# EasyEDA Pro project ProPrj_Pi Essential HAT.epro, board PCB1
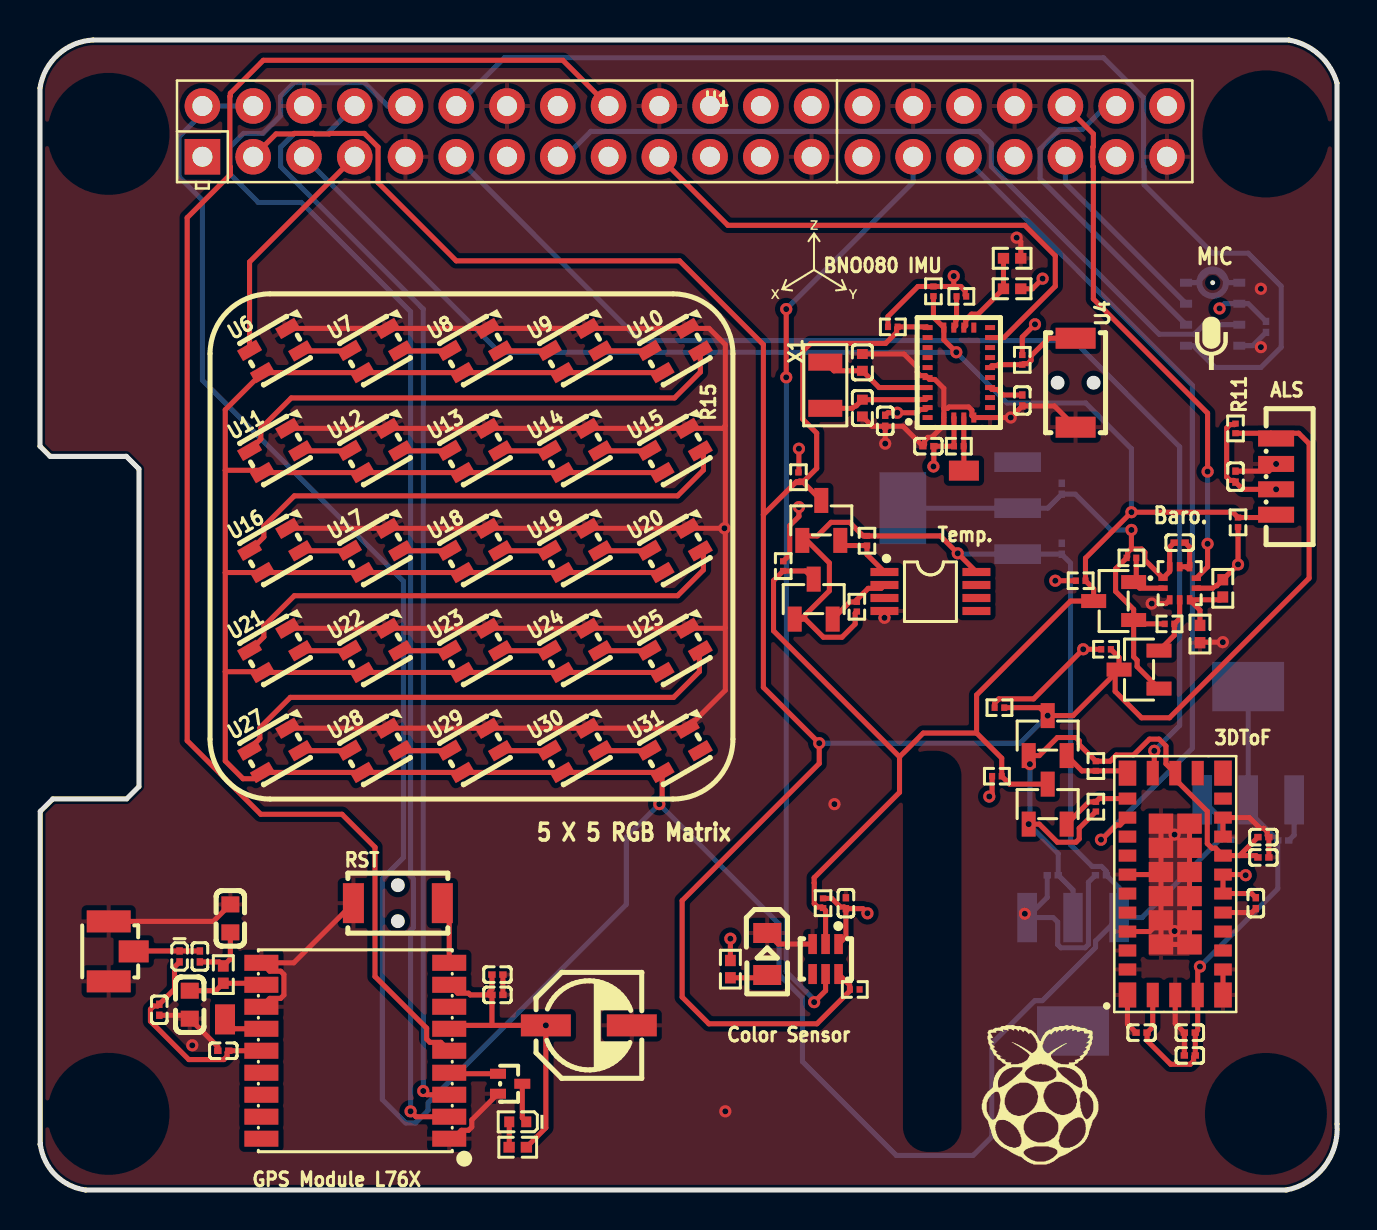
[diagram p1: board, top side]
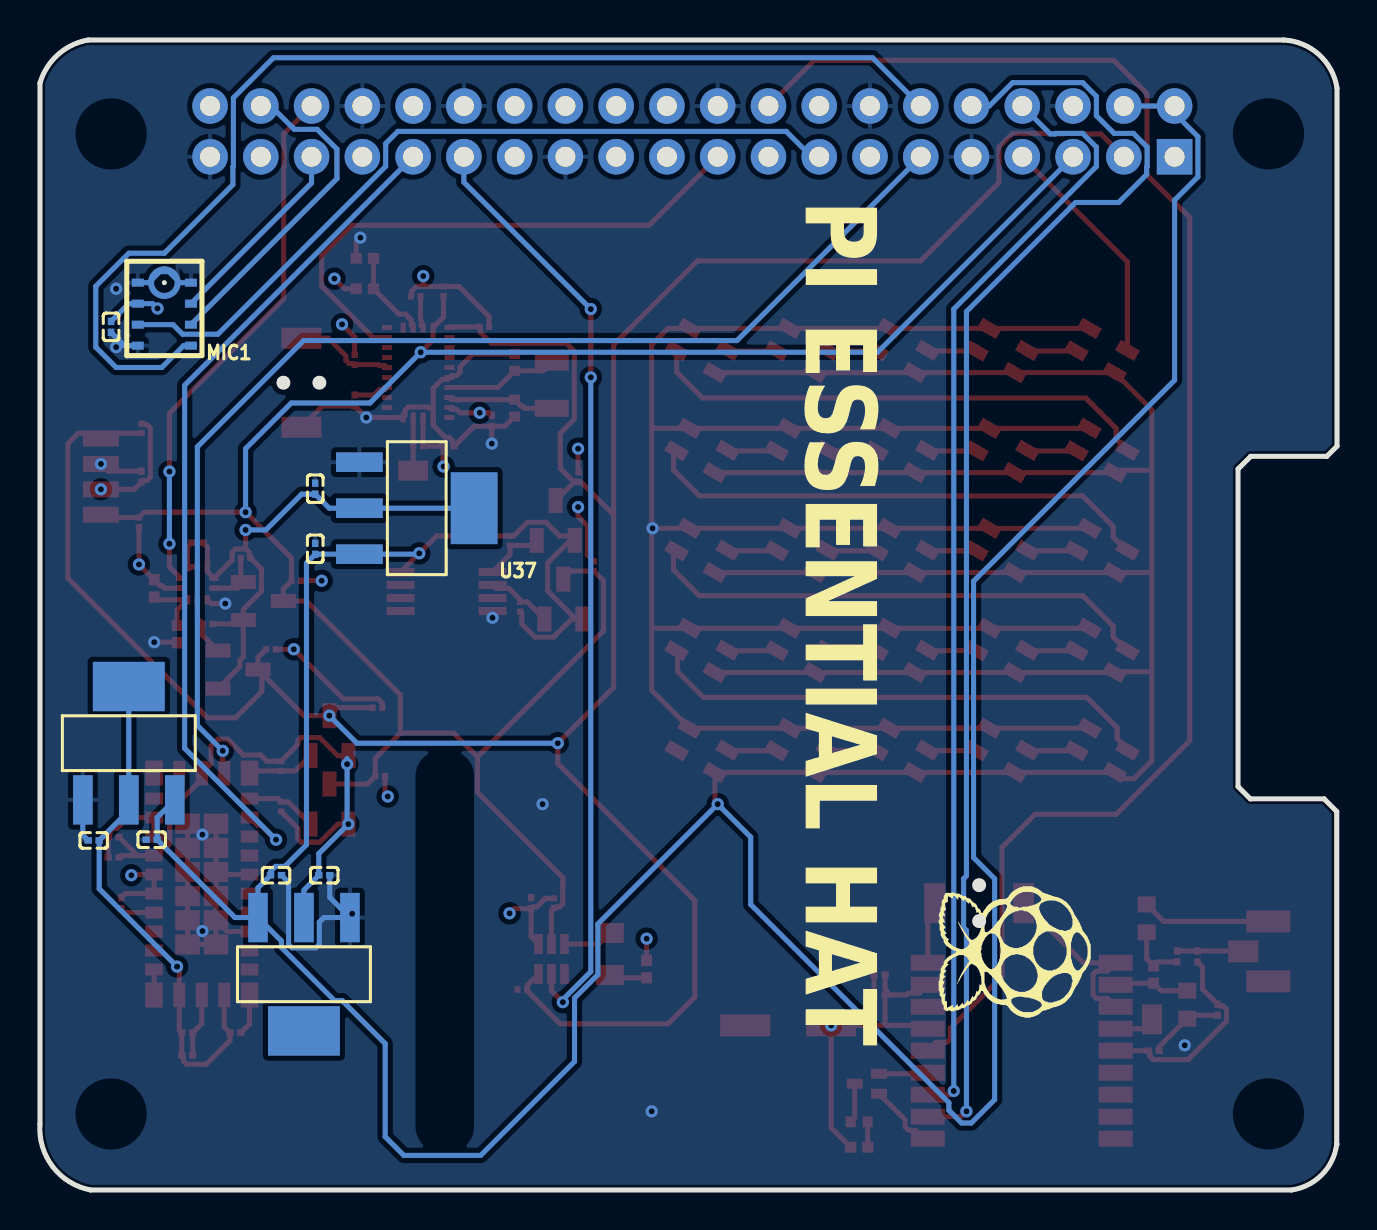
[diagram p2: board, bottom side, seen from below]

Outline 64.9 x 57.53 mm; copper layers: Top Layer, Inner1, Inner2, Bottom Layer. Coordinates in mm from the lower left corner of the outline.
Outline path: 0.01,2.3 0.01,18.94 0.64,19.57 4.34,19.57 4.95,20.18 4.95,36.07 4.32,36.7 0.51,36.7 0,37.21 0,55.12 arc(0.9,56.8) 2.67,57.53 62.48,57.53 arc(64,56.8) 64.9,55.37 64.9,3.3 arc(64.26,1.17) 62.36,0 2.29,0 arc(0.76,0.76) 0.01,2.3 ; 0.01,2.3 0,2.29
Stack: Top Layer 0.035mm Outer layer thickness 1oz / Dielectric1 0.2104mm 7628 RC49% 8.6mil / Inner1 0.0152mm Inner layer thickness / Dielectric2 1.065mm 1.1mm H/HOZ Copper / Inner2 0.0152mm Inner layer thickness / Dielectric3 0.2104mm 7628 RC49% 8.6mil / Bottom Layer 0.035mm Outer layer thickness 1oz

## Design rules (mm)
spacing copperThickness1oz (default): track to track 0.102, other pairs 0.152 to 0.3
spacing copperThickness2oz: track to track 0.203, other pairs 0.152 to 0.3
track width copperThickness1oz (default): min 0.127, default 0.254, max 2.54
track width copperThickness2oz: min 0.203, default 0.254, max 2.54
differential pair differentialPair (default): width min 0.127, default 0.254, max 2.54; gap min 0.152, default 0.152
net GND uses copperRegion
net VCC uses copperRegion

## Placement (name value [footprint] x y rotation side)
3DToF  VL53L9CXV0VE/1  [COMM-SMD_42P-L12.8-W6.1_VL53L9CXV0VE-1]  56.8 15.31 270 top
ALS  VEML7700-TR  [LED-SMD_4P-L6.8-W2.4_VEML7700-TR]  61.85 35.69 270 top
BNO080 IMU  BNO080  [LGA-28_L5.2-W3.8-P0.50-BL-1]  45.97 40.89 0 top
C1  100nF  [C0201]  40.32 14.35 270 top
C2  100nF  [C0201]  42.29 38.48 90 top
C3  22pF  [C0402]  41.15 39.12 270 top
C4  100nF  [C0201]  44.45 37.21 180 top
C5  22pF  [C0402]  41.15 41.4 90 top
C6  100nF  [C0201]  49.15 39.5 270 top
C7  100nF  [C0201]  59.82 35.69 90 top
C8  100nF  [C0201]  61.21 17.65 180 top
C9  100nF  [C0201]  61.21 16.64 180 top
C10  100nF  [C0201]  60.83 14.35 90 top
C11  100nF  [C0201]  55.12 7.87 0 top
C12  100nF  [C0201]  57.53 6.73 0 top
C13  100nF  [C0201]  57.53 7.87 0 top
C14  100nF  [C0201]  5.97 9.02 90 top
C15  100nF  [C0201]  61.34 43.18 90 bottom
C16  100uF  [CAP-SMD_BD5.0-L5.3-W5.3-RD]  27.46 8.24 180 top
C17  100nF  [C0201]  22.89 9.76 0 top
C18  DNP  [C0603]  7.49 9.27 270 top
C19  100pF  [C0201]  8 11.68 90 top
C20  4.7uF  [C0201]  22.89 10.78 180 top
C21  DNP  [C0603]  9.52 13.59 90 top
C22  100nF  [C0201]  9.17 6.97 180 top
C23  100nF  [C0201]  57.02 32.38 0 top
C24  100nF  [C0201]  62.21 17.49 0 bottom
C25  100nF  [C0201]  50.67 15.75 180 bottom
C26  100nF  [C0201]  51.12 32.08 90 bottom
C27  100nF  [C0201]  53.09 15.75 180 bottom
C28  100nF  [C0201]  59.31 17.53 180 bottom
C29  100nF  [C0201]  51.12 35.08 90 bottom
CN1  5017  [CONN-SMD_5017]  46.23 35.99 0 top
CN2  5017  [CONN-SMD_5017]  9.26 8.53 270 top
Color Sensor  TCS34725FN  [SENSOR-SMD_TCS34725FN]  39.31 11.55 270 top
GPS Module L76X  L76KB-A58  [GPSM-SMD_18P-L10.1-W9.7-P1.10]  15.78 6.97 180 top
JP1  6GHz  [ANT-SMD_UFL-R-SMT-1-10]  4.06 11.94 180 top
L1  47nH  [L0201-RD]  6.98 11.68 270 top
LED1  KT-0805W  [LED0805-R-RD]  36.39 11.81 270 top
LED3  YLED0402P  [LED0402-RD]  23.9 3.41 180 top
MIC1  INMP441  [MIC-SMD_INMP441]  58.67 43.81 0 bottom
Q1  BSS138  [SOT-23-3_L2.9-W1.3-P1.90-LS2.4-BR-1]  38.71 29.56 270 top
Q2  BSS138  [SOT-23-3_L2.9-W1.3-P1.90-LS2.4-BR-1]  50.42 19.3 270 top
Q3  BSS138  [SOT-23-3_L2.9-W1.3-P1.90-LS2.4-BR-1]  39.09 33.5 270 top
Q4  BSS138  [SOT-23-3_L2.9-W1.3-P1.90-LS2.4-BR-1]  50.42 22.73 270 top
Q5  BSS138  [SOT-23-3_L2.9-W1.3-P1.90-LS2.4-BR-1]  53.72 29.46 0 top
Q6  BSS138  [SOT-23-3_L2.9-W1.3-P1.90-LS2.4-BR-1]  54.99 26.03 0 top
Q7  CJ1012  [SOT-523_L1.6-W0.8-P1.00-LS1.6-BR]  23.52 5.32 180 top
R1  4.7kΩ  [R0201]  40.77 10.03 180 top
R2  4.7kΩ  [R0201]  39.18 14.35 270 top
R3  10kΩ  [R0201]  45.97 37.21 180 top
R4  4.7kΩ  [R0201]  42.67 43.18 180 top
R5  4.7kΩ  [R0201]  44.7 44.96 90 top
R6  10kΩ  [R0201]  46.1 44.7 180 top
R7  10kΩ  [R0201]  49.15 41.53 270 top
R8  0Ω  [R0402]  48.64 45.08 0 top
R9  0Ω  [R0402]  48.64 46.61 0 top
R10  4.7kΩ  [R0201]  59.94 33.4 90 top
R11  4.7kΩ  [R0201]  59.82 38.1 270 top
R12  4.7kΩ  [R0201]  37.19 31.21 270 top
R13  4.7kΩ  [R0201]  41.38 32.48 270 top
R14  4.7kΩ  [R0201]  47.88 20.7 0 top
R15  4.7kΩ  [R0201]  37.95 35.66 270 top
R16  4.7kΩ  [R0201]  52.83 19.18 90 top
R17  4.7kΩ  [R0201]  40.87 29.18 90 top
R18  4.7kΩ  [R0201]  48.01 24.13 0 top
R19  4.7kΩ  [R0201]  52.83 21.21 270 top
R20  4.7kΩ  [R0201]  52.07 30.48 0 top
R21  4.7kΩ  [R0201]  54.61 31.62 0 top
R22  0Ω  [R0402]  9.17 10.78 90 top
R23  4.7kΩ  [R0201]  53.34 27.05 0 top
R24  2.7kΩ  [R0402]  23.9 2.14 180 top
R25  4.7kΩ  [R0201]  56.52 28.32 0 top
R26  0Ω  [R0402]  58.04 27.81 270 top
R27  0Ω  [R0402]  59.18 30.1 90 top
R28  2.7kΩ  [R0402]  34.54 11.05 90 top
RST  BX-TS-26-3425TP  [KEY-SMD_L3.9-W3.0-LS5.0-EH]  17.91 14.35 0 top
Temp.  MCP9808-E/MS  [MSOP-8_L3.0-W3.0-P0.65-LS4.9-BL]  44.55 29.94 270 top
U1  -  [RASPI_GPIO_B+_PIN]  32.26 52.96 0 top
U4  BX-TS-26-3425TP  [KEY-SMD_L3.9-W3.0-LS5.0-EH]  51.82 40.39 270 top
U6  WS2812B-2427-V6  [LED-SMD_4P-L2.7-W2.4-P1.30_WS2812B-2427-V6]  11.76 41.99 30 top
U7  WS2812B-2427-V6  [LED-SMD_4P-L2.7-W2.4-P1.30_WS2812B-2427-V6]  16.76 41.99 30 top
U8  WS2812B-2427-V6  [LED-SMD_4P-L2.7-W2.4-P1.30_WS2812B-2427-V6]  21.76 41.99 30 top
U9  WS2812B-2427-V6  [LED-SMD_4P-L2.7-W2.4-P1.30_WS2812B-2427-V6]  26.76 41.99 30 top
U10  WS2812B-2427-V6  [LED-SMD_4P-L2.7-W2.4-P1.30_WS2812B-2427-V6]  31.76 41.99 30 top
U11  WS2812B-2427-V6  [LED-SMD_4P-L2.7-W2.4-P1.30_WS2812B-2427-V6]  11.76 36.99 30 top
U12  WS2812B-2427-V6  [LED-SMD_4P-L2.7-W2.4-P1.30_WS2812B-2427-V6]  16.76 36.99 30 top
U13  WS2812B-2427-V6  [LED-SMD_4P-L2.7-W2.4-P1.30_WS2812B-2427-V6]  21.76 36.99 30 top
U14  WS2812B-2427-V6  [LED-SMD_4P-L2.7-W2.4-P1.30_WS2812B-2427-V6]  26.76 36.99 30 top
U15  WS2812B-2427-V6  [LED-SMD_4P-L2.7-W2.4-P1.30_WS2812B-2427-V6]  31.76 36.99 30 top
U16  WS2812B-2427-V6  [LED-SMD_4P-L2.7-W2.4-P1.30_WS2812B-2427-V6]  11.76 31.99 30 top
U17  WS2812B-2427-V6  [LED-SMD_4P-L2.7-W2.4-P1.30_WS2812B-2427-V6]  16.76 31.99 30 top
U18  WS2812B-2427-V6  [LED-SMD_4P-L2.7-W2.4-P1.30_WS2812B-2427-V6]  21.76 31.99 30 top
U19  WS2812B-2427-V6  [LED-SMD_4P-L2.7-W2.4-P1.30_WS2812B-2427-V6]  26.76 31.99 30 top
U20  WS2812B-2427-V6  [LED-SMD_4P-L2.7-W2.4-P1.30_WS2812B-2427-V6]  31.76 31.99 30 top
U21  WS2812B-2427-V6  [LED-SMD_4P-L2.7-W2.4-P1.30_WS2812B-2427-V6]  11.76 26.99 30 top
U22  WS2812B-2427-V6  [LED-SMD_4P-L2.7-W2.4-P1.30_WS2812B-2427-V6]  16.76 26.99 30 top
U23  WS2812B-2427-V6  [LED-SMD_4P-L2.7-W2.4-P1.30_WS2812B-2427-V6]  21.76 26.99 30 top
U24  WS2812B-2427-V6  [LED-SMD_4P-L2.7-W2.4-P1.30_WS2812B-2427-V6]  26.76 26.99 30 top
U25  WS2812B-2427-V6  [LED-SMD_4P-L2.7-W2.4-P1.30_WS2812B-2427-V6]  31.76 26.99 30 top
U27  WS2812B-2427-V6  [LED-SMD_4P-L2.7-W2.4-P1.30_WS2812B-2427-V6]  11.76 21.99 30 top
U28  WS2812B-2427-V6  [LED-SMD_4P-L2.7-W2.4-P1.30_WS2812B-2427-V6]  16.76 21.99 30 top
U29  WS2812B-2427-V6  [LED-SMD_4P-L2.7-W2.4-P1.30_WS2812B-2427-V6]  21.76 21.99 30 top
U30  WS2812B-2427-V6  [LED-SMD_4P-L2.7-W2.4-P1.30_WS2812B-2427-V6]  26.76 21.99 30 top
U31  WS2812B-2427-V6  [LED-SMD_4P-L2.7-W2.4-P1.30_WS2812B-2427-V6]  31.76 21.99 30 top
U34  LPS22HHTR  [HLGA-10L_LPS22HBTR]  57.02 30.35 0 top
U35  AMS1117-3.3V  [SOT-223-4_L6.5-W3.5-P2.30-LS7.0-BR]  60.45 22.35 270 bottom
U36  AMS1117-1.2V  [SOT-223-4_L6.5-W3.5-P2.30-LS7.0-BR]  51.69 10.79 90 bottom
U37  AMS1117-1.8V  [SOT-223-3_L6.7-W3.7-P2.30-LS7.0-BR_2]  46.05 34.11 0 bottom
X1  32.768kHz  [OSC-SMD_L3.2-W1.5]  39.29 40.26 270 top

## Footprints (pads in the part's own frame, mm; a bottom-side part is the same pattern mirrored in y, then rotated)
ANT-SMD_UFL-R-SMT-1-10
  rect 2.2x1.1 smd: 1(0.625,1.5) 3(0.625,-1.5)
  rect 1.5x1.1 smd: 2(-0.625,0.001)
C0201
  rect 0.368x0.324 smd: 1(-0.275,0) 2(0.275,0)
C0402
  rect 0.5x0.54 smd: 1(-0.42,0) 2(0.42,0)
C0603
  rect 0.8x0.9 smd: 1(-0.7,0) 2(0.7,0)
CAP-SMD_BD5.0-L5.3-W5.3-RD
  rect 2.5x1.1 smd: 1(2.15,0) 2(-2.15,0)
COMM-SMD_42P-L12.8-W6.1_VL53L9CXV0VE-1
  rect 1.255x0.88 smd: A1(5.55,-2.39) A12(-5.55,-2.39) E1(5.55,2.39) E12(-5.55,2.39)
  rect 0.6x0.88 smd: A2(4.275,-2.39) A3(3.325,-2.39) A4(2.375,-2.39) A5(1.425,-2.39) A6(0.475,-2.39) A7(-0.475,-2.39) A8(-1.425,-2.39) A9(-2.375,-2.39) A10(-3.325,-2.39) A11(-4.275,-2.39) E2(4.275,2.39) E3(3.325,2.39) E4(2.375,2.39) E5(1.425,2.39) E6(0.475,2.39) E7(-0.475,2.39) E8(-1.425,2.39) E9(-2.375,2.39) E10(-3.325,2.39) E11(-4.275,2.39)
  rect 1.225x0.6 smd: B1(5.55,-1.125) B12(-5.55,-1.125) C1(5.55,0) C12(-5.55,0) D1(5.55,1.125) D12(-5.55,1.125)
  rect 1.008x1.225 smd: B4(3.02,-0.713) B5(1.812,-0.713) B6(0.604,-0.713) B7(-0.604,-0.713) B8(-1.812,-0.713) B9(-3.02,-0.713) D4(3.02,0.713) D5(1.812,0.713) D6(0.604,0.713) D7(-0.604,0.713) D8(-1.812,0.713) D9(-3.02,0.713)
CONN-SMD_5017
  rect 1.5x1 smd: 1(0,0)
GPSM-SMD_18P-L10.1-W9.7-P1.10
  rect 1.7x0.8 smd: 1(-4.7,4.4) 2(-4.7,3.3) 3(-4.7,2.2) 4(-4.7,1.1) 5(-4.7,0) 6(-4.7,-1.1) 7(-4.7,-2.2) 8(-4.7,-3.3) 9(-4.7,-4.4) 10(4.7,-4.4) 11(4.7,-3.3) 12(4.7,-2.2) 13(4.7,-1.1) 14(4.7,0) 15(4.7,1.1) 16(4.7,2.2) 17(4.7,3.3) 18(4.7,4.4)
HLGA-10L_LPS22HBTR
  rect 0.465x0.28 smd: 1(-0.833,0.255) 2(-0.833,-0.245) 6(0.833,-0.245) 7(0.833,0.255)
  rect 0.28x0.465 smd: 3(-0.5,-0.828) 4(0,-0.828) 5(0.5,-0.828) 8(0.5,0.828) 9(0,0.828) 10(-0.5,0.828)
KEY-SMD_L3.9-W3.0-LS5.0-EH
  rect 1.05x2 smd: 1(-2.225,0) 2(2.225,0)
L0201-RD
  rect 0.368x0.324 smd: 1(-0.275,0) 2(0.275,0)
LED0402-RD
  rect 0.5x0.54 smd: 1(-0.425,0) 2(0.425,0)
LED0805-R-RD
  rect 1x1.399 smd: 1(1.05,0) 2(-1.05,0)
LED-SMD_4P-L2.7-W2.4-P1.30_WS2812B-2427-V6
  rect 1.1x0.6 smd: 1(-1.1,0.65) 2(-1.1,-0.635) 3(1.1,-0.65) 4(1.1,0.65)
LED-SMD_4P-L6.8-W2.4_VEML7700-TR
  rect 0.8x1.8 smd: 1(1.905,0) 2(0.635,0) 3(-0.635,0) 4(-1.905,0)
LGA-28_L5.2-W3.8-P0.50-BL-1
  rect 0.5x0.25 smd: 1(-1.563,-2.25) 6(1.563,-2.25) 7(1.563,-1.75) 8(1.563,-1.25) 9(1.563,-0.75) 10(1.563,-0.25) 11(1.563,0.25) 12(1.563,0.75) 13(1.563,1.25) 14(1.563,1.75) 15(1.563,2.25) 20(-1.563,2.25) 21(-1.563,1.75) 22(-1.563,1.25) 23(-1.563,0.75) 24(-1.563,0.25) 25(-1.563,-0.25) 26(-1.563,-0.75) 27(-1.563,-1.25) 28(-1.563,-1.75)
  rect 0.25x0.5 smd: 2(-0.75,-2.25) 3(-0.25,-2.25) 4(0.25,-2.25) 5(0.75,-2.25) 16(0.75,2.25) 17(0.25,2.25) 18(-0.25,2.25) 19(-0.75,2.25)
MIC-SMD_INMP441
  rect 0.6x0.4 smd: 1(-1.33,1.575) 2(-1.33,0.525) 3(-1.33,-0.525) 4(-1.33,-1.575) 6(1.33,-1.575) 7(1.33,-0.525) 8(1.33,0.525) 9(1.33,1.575)
  custom 0.966x1.626 smd: 5(-0.661,-1.575)
  custom 0.963x1.626 smd: 5(0.664,-1.575)
MSOP-8_L3.0-W3.0-P0.65-LS4.9-BL
  rect 0.406x1.397 smd: 1(-0.975,-2.3) 2(-0.325,-2.3) 3(0.325,-2.3) 4(0.975,-2.3) 5(0.975,2.3) 6(0.325,2.3) 7(-0.325,2.3) 8(-0.975,2.3)
OSC-SMD_L3.2-W1.5
  rect 0.85x1.7 smd: 1(-1.155,0) 2(1.155,0)
R0201
  rect 0.303x0.324 smd: 1(-0.241,0) 2(0.241,0)
R0402
  rect 0.566x0.54 smd: 1(-0.433,0) 2(0.433,0)
RASPI_GPIO_B+_PIN
  rect 1.778x1.778 hole 1: 1(-24.13,-1.27)
  round 1.778 hole 1: 2(-24.13,1.27) 3(-21.59,-1.27) 4(-21.59,1.27) 5(-19.05,-1.27) 6(-19.05,1.27) 7(-16.51,-1.27) 8(-16.51,1.27) 9(-13.97,-1.27) 10(-13.97,1.27) 11(-11.43,-1.27) 12(-11.43,1.27) 13(-8.89,-1.27) 14(-8.89,1.27) 15(-6.35,-1.27) 16(-6.35,1.27) 17(-3.81,-1.27) 18(-3.81,1.27) 19(-1.27,-1.27) 20(-1.27,1.27) 21(1.27,-1.27) 22(1.27,1.27) 23(3.81,-1.27) 24(3.81,1.27) 25(6.35,-1.27) 26(6.35,1.27) 27(8.89,-1.27) 28(8.89,1.27) 29(11.43,-1.27) 30(11.43,1.27) 31(13.97,-1.27) 32(13.97,1.27) 33(16.51,-1.27) 34(16.51,1.27) 35(19.05,-1.27) 36(19.05,1.27) 37(21.59,-1.27) 38(21.59,1.27) 39(24.13,-1.27) 40(24.13,1.27)
SENSOR-SMD_TCS34725FN
  rect 1x0.43 smd: 1(-0.75,0.65) 2(-0.75,0) 3(-0.75,-0.65) 4(0.75,-0.65) 5(0.75,0) 6(0.75,0.65)
SOT-23-3_L2.9-W1.3-P1.90-LS2.4-BR-1
  rect 1.25x0.7 smd: 1(1,-0.95) 2(1,0.95) 3(-1,0)
SOT-223-3_L6.7-W3.7-P2.30-LS7.0-BR_2
  rect 2.34x0.98 smd: 1(2.87,-2.3) 2(2.87,0) 3(2.87,2.3)
  rect 2.34x3.6 smd: 2(-2.87,0)
SOT-223-4_L6.5-W3.5-P2.30-LS7.0-BR
  rect 2.47x0.98 smd: 1(2.835,-2.3) 2(2.835,0) 3(2.835,2.3)
  rect 2.47x3.6 smd: 4(-2.835,0)
SOT-523_L1.6-W0.8-P1.00-LS1.6-BR
  rect 0.8x0.5 smd: 1(0.608,-0.5) 2(0.608,0.5) 3(-0.608,0)

## Nets
1.2V: 3DToF.C12 3DToF.E8 C8.2 C9.2 C25.1 Q2.1 Q4.1 R16.1 R19.1 U36.2
1.8V: C23.1 C29.1 Q5.1 Q6.1 R21.1 R25.1 U34.1 U34.10 U37.2
+5V: C26.1 C27.1 C28.2 Q1.1 Q3.1 R13.1 R17.1 Temp..8 U1.2 U1.4 U6.2 U7.2 U8.2 U9.2 U10.2 U11.2 U12.2 U13.2 U14.2 U15.2 U16.2 U17.2 U18.2 U19.2 U20.2 U21.2 U22.2 U23.2 U24.2 U25.2 U27.2 U28.2 U29.2 U30.2 U31.2 U35.3 U36.3 U37.3
GND: 3DToF.A1 3DToF.A2 3DToF.A3 3DToF.A4 3DToF.A7 3DToF.B4 3DToF.B5 3DToF.B6 3DToF.B7 3DToF.B8 3DToF.B9 3DToF.C1 3DToF.D4 3DToF.D5 3DToF.D6 3DToF.D7 3DToF.D8 3DToF.D9 3DToF.E1 3DToF.E2 3DToF.E4 3DToF.E5 3DToF.E9 3DToF.E10 ALS.3 BNO080 IMU.2 BNO080 IMU.5 BNO080 IMU.6 BNO080 IMU.25 C1.1 C2.1 C3.2 C4.2 C5.2 C6.2 C7.2 C8.1 C9.1 C10.1 C11.1 C12.1 C13.1 C14.1 C15.1 C16.2 C17.2 C18.2 C20.1 C21.2 C22.2 C24.2 C25.2 C26.2 C27.2 C28.1 C29.2 Color Sensor.3 GPS Module L76X.1 GPS Module L76X.10 GPS Module L76X.12 JP1.1 JP1.3 LED1.2 MIC1.4 MIC1.5 MIC1.6 MIC1.9 Q7.2 R9.2 R26.2 RST.1 Temp..4 U1.6 U1.9 U1.14 U1.20 U1.25 U1.30 U1.34 U1.39 U4.2 U6.4 U7.4 U8.4 U9.4 U10.4 U11.4 U12.4 U13.4 U14.4 U15.4 U16.4 U17.4 U18.4 U19.4 U20.4 U21.4 U22.4 U23.4 U24.4 U25.4 U27.4 U28.4 U29.4 U30.4 U31.4 U34.3 U35.1 U36.1 U37.1
VCC: 3DToF.E6 3DToF.E7 ALS.2 BNO080 IMU.3 BNO080 IMU.28 C1.2 C2.2 C4.1 C7.1 C10.2 C15.2 C16.1 C17.1 C20.2 Color Sensor.1 GPS Module L76X.6 GPS Module L76X.8 MIC1.7 R2.1 R3.2 R4.2 R5.2 R6.1 R7.1 R8.2 R10.1 R11.1 R12.1 R14.1 R15.1 R18.1 R20.1 R23.1 R24.1 R27.2 U1.1 U1.17 U34.6
VDD_RF: C14.2 C22.1 GPS Module L76X.14 L1.2
1PPS: GPS Module L76X.4 Q7.1
B0_INT: BNO080 IMU.14 U1.19
BA_SCL: Q5.2 R21.2 U34.2
BA_SDA: Q6.2 R25.2 U34.4
BARO_INT: U1.36 U34.7
C_INT: Color Sensor.5 U1.29
DIN: U1.7 U6.1
GPS_EN: GPS Module L76X.5 U1.18
LED: R28.2 U1.13
MIC_EN: MIC1.8 U1.15
P_VCC: 3DToF.B1 3DToF.D1 C11.2 C12.2 C13.2 C24.1 U35.2 U35.4
RX: GPS Module L76X.3 U1.8
SCK: MIC1.1 U1.12
SCL: ALS.1 BNO080 IMU.19 Color Sensor.2 Q1.3 Q2.3 Q5.3 R2.2 R5.1 R10.2 R12.2 R14.2 R20.2 U1.5
SCL_1.2: 3DToF.A11 Q2.2 R16.2
SD: MIC1.2 U1.38
SDA: ALS.4 BNO080 IMU.20 Color Sensor.6 Q3.3 Q4.3 Q6.3 R1.2 R4.1 R11.2 R15.2 R18.2 R23.2 U1.3
SDA_1.2: 3DToF.A12 Q4.2 R19.2
TEMP_SCL: Q1.2 R17.2 Temp..2
TEMP_SDA: Q3.2 R13.2 Temp..1
TOF_EN: 3DToF.B12 U1.11
TOF_INT: 3DToF.A10 U1.31
TX: GPS Module L76X.2 U1.10
WS: MIC1.3 U1.35
$1N44: BNO080 IMU.27 C3.1 X1.2
$1N45: BNO080 IMU.26 C5.1 X1.1
$1N46: BNO080 IMU.9 C6.1
$1N57: BNO080 IMU.11 R7.2 U4.1
$1N59: BNO080 IMU.18 R6.2
$1N64: BNO080 IMU.17 R8.1 R9.1
$1N67: BNO080 IMU.4 CN1.1 R3.1
$1N145: R26.1 R27.1 U34.5
$1N148: C23.2 U34.8 U34.9
$1N179: C19.2 JP1.2 L1.1
$1N184: C19.1 C21.1 R22.2
$1N185: C18.1 GPS Module L76X.11 R22.1
$1N189: LED3.1 Q7.3
$1N190: LED3.2 R24.2
$1N192: CN2.1 GPS Module L76X.13
$1N195: GPS Module L76X.9 RST.2
$1N260: U6.3 U7.1
$1N261: U7.3 U8.1
$1N262: U8.3 U9.1
$1N263: U9.3 U10.1
$1N264: U14.3 U15.1
$1N265: U13.3 U14.1
$1N266: U12.3 U13.1
$1N267: U11.3 U12.1
$1N268: U16.3 U17.1
$1N269: U17.3 U18.1
$1N270: U18.3 U19.1
$1N271: U19.3 U20.1
$1N272: U24.3 U25.1
$1N273: U23.3 U24.1
$1N274: U22.3 U23.1
$1N275: U21.3 U22.1
$1N276: U27.3 U28.1
$1N277: U28.3 U29.1
$1N278: U29.3 U30.1
$1N280: U30.3 U31.1
$1N292: U25.3 U27.1
$1N293: U20.3 U21.1
$1N294: U15.3 U16.1
$1N295: U10.3 U11.1
$1N301: LED1.1 R28.1

Pads without a net: 3DToF A5 A6 A8 A9 D12 E3 E11 E12; BNO080 IMU 1 7 8 10 12 13 15 16 21 22 23 24; Color Sensor 4; GPS Module L76X 7 15 16 17 18; R1 1; Temp. 3 5 6 7; U1 16 21 22 23 24 26 27 28 32 33 37 40; U31 3; U36 4

## Via types
v1: diameter 0.61, hole 0.305, Top Layer to Bottom Layer, 52 vias

## Routing (per net, layer and track width the routed paths; a pad name or vN(x,y) marks a point on that pad's centre or on a via; arc(x,y) is an arc through that point)
1.2V: length 31.9
  Top Layer w0.254: Q4.1 50,21.73 50.9,22.64 51.83,22.64 52,22.47 52,22.28 R19.1 53.55,21.45 53.86,21.76 54.72,21.76 55.51,22.55 55.99,22.55 56.34,22.21 56.34,21.32 3DToF.C12 56.8,20.55 58.41,18.94 58.41,17.33 58.64,17.1 58.82,17.1 3DToF.E8 60.02,16.73 ; v1(49.47,18.3) 50,18.3 50.9,17.4 51.83,17.4 52,17.56 52,18.1 R16.1 ; 60.02,16.73 60.85,16.73 C9.2 ; 60.02,16.73 C8.2
  Bottom Layer w0.254: U36.2 51.69,15.01 C25.1 50.95,16.83 v1(49.47,18.3) 49.53,18.36 49.53,21.59
  vias: v1(49.53,21.3)
1.8V: length 27.7
  Top Layer w0.254: 54.58,32.06 55.12,32.06 55.28,31.9 55.28,31.52 U34.1 56.52,30.94 U34.10 56.52,32.16 C23.1 ; 54.58,32.06 54.42,31.9 54.42,31.68 R21.1 53.82,31.07 53.82,29.95 54.72,29.04 Q5.1 ; 54.58,32.06 54.61,32.09 v1(54.61,33.02) ; Q6.1 54.89,26.18 54.89,26.5 54.72,26.67 Q5.1 ; Q5.1 54.91,28.32 R25.1
  Bottom Layer w0.254: v1(54.61,33.02) 53.59,33.02 51.8,34.81 C29.1 50.42,34.11 U37.2 U37.2
+5V: length 305.8
  Top Layer w0.254: 38.08,28.56 39.5,29.97 39.5,31.37 38.37,32.5 Q3.1 38.37,32.72 38.9,32.72 39.58,33.4 40.51,33.4 41.19,32.72 R13.1 45.05,32.72 v1(45.92,31.85) 46.85,30.92 ; 38.08,28.56 38.29,28.56 39.2,27.66 40.13,27.66 40.79,28.31 40.79,28.85 R17.1 ; 38.08,28.56 Q1.1 ; v1(30.99,19.3) 31.13,19.44 31.13,20.89 11.13,20.89 10.81,20.57 10.16,20.57 9.27,21.46 9.27,25.93 ; 31.13,25.89 11.13,25.89 11.09,25.93 9.27,25.93 ; 9.27,36 9.27,30.88 ; 9.27,36 9.27,39.03 11.13,40.89 31.13,40.89 ; 9.27,36 11.01,36 11.13,35.89 31.13,35.89 ; 9.27,30.88 9.28,30.89 31.13,30.89 ; 9.27,30.88 9.27,25.93
  Bottom Layer w0.254: v1(45.92,31.85) 45.96,31.81 U37.3 51.12,31.81 C26.1 51.56,31.37 51.56,17.27 52.64,16.19 53.11,16.19 53.36,15.94 C27.1 53.99,15.12 U36.3 ; U36.3 52.81,12.45 52.81,12.13 50.16,9.47 49.77,9.47 47.62,7.33 47.62,2.67 46.69,1.73 42.84,1.73 38.15,6.43 38.15,9.61 36.98,10.77 36.98,13.31 v1(30.99,19.3) 29.34,17.65 29.34,14.29 19.42,4.37 19.42,3.99 18.78,3.35 18.3,3.35 17.13,4.52 17.13,15.57 18.19,16.63 18.19,30.45 8.13,40.51 8.13,49.52 6.96,50.68 6.96,52.69 8.13,53.86 U1.2 U1.4 ; U36.3 55.14,13.63 C28.2 59.03,18.63 U35.3
GND: length 228.6
  Top Layer w0.254: 45.22,39.1 45.41,39.1 45.48,39.17 46.46,39.17 46.63,39.01 46.63,38.74 BNO080 IMU.5 BNO080 IMU.6 v1(48.57,38.64) C6.2 50.75,39.22 U4.2 ; 45.22,39.1 BNO080 IMU.2 45.22,38.26 44.62,37.65 44.42,37.65 44.26,37.49 44.26,37.3 C4.2 43.18,38.21 C2.1 ; 45.22,39.1 45.22,40.1 44.78,40.55 44.51,40.55 BNO080 IMU.25 44.31,40.74 44.05,40.74 43.88,40.9 43.88,41.17 43.23,41.82 C5.2 ; C22.2 8.9,7.17 C18.2 7.32,8.74 C14.1 ; 54.41,9.76 54.41,8.31 C11.1 ; 3DToF.B7 55.96,15.78 54.41,15.78 ; 3DToF.B7 3DToF.B6 3DToF.B5 ; 3DToF.B7 3DToF.B8 3DToF.B9 ; 54.41,12.93 55.53,12.93 3DToF.B5 ; C20.1 C17.2 ; U34.3 56.33,29.34 v1(55.63,29.34) ; R9.2 49.07,47.43 v1(48.87,47.64) ; C3.2 41.64,38.21 C2.1 ; U11.4 U12.4 U13.4 U14.4 U15.4 34.17,38.1 34.29,38.23 ; GPS Module L76X.12 11.5,9.59 12.04,9.59 12.21,9.75 12.21,10.78 12.04,10.95 11.5,10.95 GPS Module L76X.10 12.7,11.37 RST.1 ; 34.29,33.15 v1(34.25,33.1) U20.4 U19.4 U18.4 U17.4 U16.4 ; 34.29,33.15 34.29,38.23 ; 34.29,33.15 34.29,28.14 ; C9.1 C8.1 61.4,17.74 61.4,17.93 61.24,18.09 61.05,18.09 60.51,18.63 3DToF.E10 3DToF.E9 ; Color Sensor.3 36.94,12.3 36.39,12.86 ; U21.4 U22.4 U23.4 U24.4 U25.4 34.26,28.1 34.29,28.14 ; U27.4 U28.4 U29.4 U30.4 U31.4 34.29,25 34.29,28.14 ; 3DToF.B5 3DToF.B4 3DToF.D4 3DToF.D5 3DToF.D6 3DToF.D7 3DToF.D8 3DToF.D9 ; 3DToF.C1 56.8,8.33 C13.1 C12.1 ; C2.1 v1(42.29,37.34) ; C7.2 61.49,35.96 v1(61.85,36.32) ; 34.29,38.23 34.29,42.29 33.48,43.1 U10.4 U9.4 U8.4 U7.4 U6.4 ; JP1.3 8.67,13.44 C21.2 ; GPS Module L76X.1 20.67,2.57 21.09,2.99 21.44,2.99 21.61,3.15 21.61,3.51 Q7.2 ; 3DToF.E5 60.64,13.88 C10.1 ; v1(59.18,27.41) 58.06,27.41 58.04,27.38 ; 3DToF.E1 3DToF.E2
  Bottom Layer w0.254: U35.1 62.75,17.76 C24.2 ; C25.2 50.4,14.64 U36.1 50.69,13.63 50.92,13.4 50.92,12.28 51.08,12.12 52.29,12.12 52.46,12.28 52.46,15.39 C27.2 ; MIC1.6 59.45,45.39 58.9,45.94 58.45,45.94 57.89,45.39 MIC1.4 ; C15.1 60.68,42.24 60,42.24
  vias: v1(7.62,7.24) v1(34.29,3.94) v1(39.75,19.3) v1(42.25,28.63) v1(49.28,13.82) v1(56.77,17.78) v1(56.77,12.95) v1(61.09,45.08) v1(61.09,42.16)
VCC: length 65.1
  Top Layer w0.254: 22.48,9.91 22.61,10.04 C20.2 ; v1(60.33,15.75) 60.29,15.78 3DToF.E7 3DToF.E6 60.63,14.83 C10.2 ; v1(47.5,19.68) 47.64,19.82 R14.1 ; C1.2 41.17,14.07 v1(41.4,13.84) ; C1.2 40.32,12.67 Color Sensor.1 ; C1.2 40.24,14.16 40.05,14.16 39.62,14.59 R2.1 ; v1(37.97,37.08) 37.97,35.92 R15.1 ; v1(44.7,36.19) 44.72,36.22 C4.1 R3.2 45.73,38.64 BNO080 IMU.3 ; 22.56,8.24 v1(25.31,8.24) 25.31,3.11 R24.1 ; 22.56,8.24 22.61,8.29 C17.1 ; 22.56,8.24 20.65,8.24 GPS Module L76X.6 ; 45.71,45.2 45.72,45.21 v1(45.72,45.72) ; 45.71,45.2 46.07,45.2 46.29,44.98 46.29,44.76 R6.1 ; 45.71,45.2 R5.2 43.93,45.2 42.43,43.7 R4.2 ; R7.1 49.15,42.67 v1(49.78,43.31) ; v1(50.17,45.59) 49.66,45.08 R8.2 ; R23.1 v1(52.2,27.05) 49.72,24.57 47.98,24.57 47.76,24.35 R18.1 ; v1(50.8,30.48) R20.1 ; 22.48,9.76 21.53,9.76 21.44,9.85 20.9,9.85 GPS Module L76X.8 ; R11.1 59.76,38.29 59.54,38.29 59.38,38.13 59.38,35.66 59.54,35.5 59.73,35.5 C7.1 60.18,35.05 v1(61.85,35.05) ; U34.6 58.68,30.11 58.8,30.23 58.88,30.23 R27.2 v1(59.94,31.29) R10.1 ; R12.1 37.51,31.78 37.51,33.24 37.97,33.7 v1(37.97,34.16) ; BNO080 IMU.28 44.31,39.05 44.05,39.05 43.88,38.88 v1(42.9,38.88) 42.42,38.88 C2.2
  Bottom Layer w0.254: v1(59.02,44.1) 59.26,44.34 MIC1.7 60.46,44.34 C15.2
VDD_RF: length 10.3
  Top Layer w0.254: L1.2 6.73,11.16 6.73,10.05 C14.2 5.88,9.21 5.69,9.21 5.53,9.04 5.53,8.44 7.44,6.53 9.2,6.53 9.36,6.69 9.36,6.88 C22.1 GPS Module L76X.14
1PPS: length 2.5
  Top Layer w0.254: GPS Module L76X.4 20.53,5.82 Q7.1
B0_INT: length 27.7
  Top Layer w0.254: BNO080 IMU.14 48.23,42.64 50.8,45.21 50.8,46.74 49.28,48.26 34.42,48.26 U1.19
BA_SCL: length 2.9
  Top Layer w0.254: U34.2 55.03,30.11 Q5.2 54.85,30.54 R21.2
BA_SDA: length 3
  Top Layer w0.254: Q6.2 56.76,27.75 R25.2 57.02,28.59 U34.4
BARO_INT: length 26.8
  Top Layer w0.254: U1.36 52.7,52.83 52.7,52.2 52.68,52.17 52.68,51.2 52.7,51.18 52.7,44.58 58.42,38.86 v1(58.42,35.94) ; v1(58.42,32.33) 58.42,31.17 U34.7
  Bottom Layer w0.254: v1(58.42,32.33) v1(58.42,35.94)
C_INT: length 46.8
  Top Layer w0.254: v1(37.34,40.65) v1(37.34,44.07) ; v1(38.73,9.4) 39.31,9.97 Color Sensor.5
  Bottom Layer w0.254: v1(37.34,44.07) 43.69,50.42 U1.29 ; v1(37.34,40.65) 37.34,10.92 38.61,9.65
DIN: length 11.9
  Top Layer w0.254: U1.7 10.49,46.43 U6.1
GPS_EN: length 77.5
  Top Layer w0.254: U1.18 26.16,56.51 11.18,56.51 9.52,54.86 9.52,54.74 9.5,54.71 9.5,51.2 9.52,51.18 9.52,50.8 7.37,48.64 7.37,22.48 11.05,18.8 15.11,18.8 16.76,17.14 16.76,10.68 19.35,8.1 19.35,7.55 19.51,7.39 20.06,7.39 GPS Module L76X.5
LED: length 46.6
  Top Layer w0.254: 34.54,11.48 v1(34.54,12.57)
  Inner1 w0.254: U1.13 23.37,20.7 31.5,12.57 v1(34.54,12.57)
MIC_EN: length 39.7
  Bottom Layer w0.254: MIC1.8 58.24,43.29 57.76,42.81 55.99,42.81 47.6,51.2 47.6,52.35 46.99,52.96 27.56,52.96 26.29,51.69 U1.15
P_VCC: length 26.4
  Top Layer w0.254: 3DToF.B1 55.68,8.16 C11.2 55.39,7.47 56.58,6.29 57.56,6.29 57.72,6.45 57.72,6.65 C12.2 C13.2 57.93,8 3DToF.D1 57.93,11.06 v1(58.04,11.18)
  Bottom Layer w0.254: U35.4 U35.2 60.45,18.97 C24.1 61.93,15.07 v1(58.04,11.18)
RX: length 56.1
  Top Layer w0.254: v1(19.18,4.95) 19.36,4.77 GPS Module L76X.3
  Bottom Layer w0.254: U1.8 14.35,52.83 14.1,52.83 14.07,52.86 12.72,52.86 12.04,52.17 12.04,51.2 19.18,44.07 v1(19.18,4.95)
SCK: length 58.2
  Bottom Layer w0.254: 57.34,42.24 57.71,42.24 58.8,41.15 61.09,41.15 62.1,42.16 62.1,45.21 60.45,46.86 58.67,46.86 55.24,50.29 55.24,51.18 55.22,51.2 55.22,54.63 53.21,56.64 23.24,56.64 U1.12
SCL: length 111.4
  Top Layer w0.254: 43.01,21.67 43.01,19.89 38.73,15.62 38.73,15.37 38.74,15.36 38.74,14.32 38.9,14.16 39.13,14.16 R2.2 39.31,13.98 Color Sensor.2 ; 43.01,21.67 44.2,22.86 46.86,22.86 ; 43.01,21.67 36.7,27.97 36.7,30.48 R12.2 38.3,30.97 Q1.3 ; ALS.1 61.71,33.64 R10.2 59.68,33.91 v1(54.61,33.91) 52.31,31.61 R20.2 52.72,30.07 Q5.3 51.56,29.46 46.86,24.76 46.86,22.86 ; 46.86,22.86 48.12,21.6 R14.2 48.52,20.3 Q2.3 ; v1(45.85,41.91) 45.22,42.53 BNO080 IMU.19 44.7,43.66 R5.1
  Bottom Layer w0.254: v1(54.61,33.91) 54.61,37.08 52.32,39.37 48.39,39.37 v1(45.85,41.91) 22.99,41.91 U1.5
SCL_1.2: length 3.6
  Top Layer w0.254: 54.41,19.58 52.99,19.58 R16.2 52.48,19.42 Q2.2
SD: length 16.5
  Bottom Layer w0.254: U1.38 53.34,54.23 52.17,53.06 51.03,53.06 50.04,52.07 50.04,50.6 MIC1.2
SDA: length 142.1
  Top Layer w0.254: R15.2 38,35.47 38.23,35.47 38.86,36.1 38.86,37.86 38.16,38.56 38.16,41.95 38.56,42.35 42.31,42.35 42.86,42.9 42.86,43.13 R4.1 44.37,43.18 BNO080 IMU.20 ; R15.2 37.83,35.41 36.2,33.78 ; R15.2 38.18,35.41 Q3.3 ; 61.58,37.86 62.98,37.86 63.5,37.34 63.5,30.61 56.52,23.62 55.12,23.62 53.8,24.94 53.8,25.84 ; 61.58,37.86 ALS.4 ; 61.58,37.86 R11.2 ; 53.8,25.84 Q6.3 53.99,26.64 R23.2 ; 53.8,25.84 51.69,23.73 v1(50.42,23.73) 50.02,24.13 R18.2 ; U1.3 11.81,52.83 12.7,52.83 12.72,52.86 13.69,52.86 13.72,52.83 14.48,52.83 14.5,52.86 16.23,52.86 16.92,52.17 16.92,50.39 20.83,46.48 32,46.48 36.2,42.29 36.2,33.78 ; 36.2,33.78 36.2,25.15 v1(38.99,22.35) 38.99,21.34 32.13,14.48 32.13,9.65 33.47,8.31 38.87,8.31 40.51,9.95 40.51,10.25 Color Sensor.6
  Bottom Layer w0.254: v1(38.99,22.35) 49.04,22.35 v1(50.42,23.73)
SDA_1.2: length 3.4
  Top Layer w0.254: Q4.2 52.13,20.97 R19.2 54.3,20.97 54.41,20.86
TEMP_SCL: length 3.4
  Top Layer w0.254: 42.25,30.27 42.09,30.1 41.44,30.1 40.87,29.53 R17.2 40.52,29.42 Q1.2
TEMP_SDA: length 3.1
  Top Layer w0.254: 42.25,30.92 41.38,31.79 R13.2 40.3,32.24 Q3.2
TOF_EN: length 59.1
  Top Layer w0.254: v1(55.75,21.97) 55.75,20.93 3DToF.B12
  Bottom Layer w0.254: v1(55.75,21.97) 57.02,23.24 57.02,37.18 51.71,42.49 30.02,42.49 U1.11
TOF_INT: length 42.6
  Top Layer w0.254: 54.41,18.63 54.04,18.26 53.86,18.26 53.12,17.53 v1(53.09,17.53)
  Bottom Layer w0.254: U1.31 57.66,40.26 57.66,22.1 v1(53.09,17.53)
TX: length 66.6
  Top Layer w0.254: GPS Module L76X.2 18.81,3.67 v1(18.54,3.94)
  Bottom Layer w0.254: v1(18.54,3.94) 18.54,12.99 18.68,13.13 18.68,15.57 18.54,15.71 18.54,43.94 13.08,49.4 10.92,49.4 9.52,50.8 9.52,51.18 9.5,51.2 9.5,52.17 10.18,52.86 11.15,52.86 12.04,53.74 12.04,54.71 12.72,55.4 16.23,55.4 17.4,54.23 U1.10
WS: length 9.8
  Bottom Layer w0.254: U1.35 51.31,50.38 MIC1.3
$1N44: length 5.3
  Top Layer w0.254: BNO080 IMU.27 44.31,39.55 44.05,39.55 44.03,39.54 C3.1 40.84,39.22 40.76,39.22 40.64,39.1 X1.2
$1N45: length 5.6
  Top Layer w0.254: X1.1 39.72,40.98 C5.1 41.99,40.14 BNO080 IMU.26
$1N46: length 1.8
  Top Layer w0.254: BNO080 IMU.9 47.63,40.05 47.9,40.05 48.18,39.77 C6.1
$1N57: length 5
  Top Layer w0.254: BNO080 IMU.11 47.63,41.24 47.9,41.24 47.95,41.29 R7.2 49.2,41.34 49.43,41.34 49.59,41.5 49.59,41.73 50.47,42.61 U4.1
$1N59: length 1.6
  Top Layer w0.254: BNO080 IMU.18 45.82,43.24 45.82,43.51 45.86,43.55 R6.2
$1N64: length 4.5
  Top Layer w0.254: 48.21,46.61 48.21,45.08 46.94,43.81 46.61,43.81 46.43,43.64 46.43,43.62 46.32,43.51 46.32,43.24 BNO080 IMU.17
$1N67: length 2.7
  Top Layer w0.254: BNO080 IMU.4 46.22,37.22 R3.1 46.23,37.2 CN1.1
$1N145: length 3.2
  Top Layer w0.254: R26.1 58.04,29.01 U34.5 59.04,29.53 R27.1
$1N148: length 1.7
  Top Layer w0.254: U34.8 57.52,32.16 C23.2 ; 57.4,31.11 57.34,31.18 U34.9
$1N179: length 3.3
  Top Layer w0.254: C19.2 L1.1 4.71,11.96 JP1.2
$1N184: length 3.1
  Top Layer w0.254: C19.1 8.97,11.41 R22.2 9.52,11.56 C21.1
$1N185: length 3.8
  Top Layer w0.254: GPS Module L76X.11 11,10.34 9.17,10.34 8.8,9.97 C18.1
$1N189: length 2
  Top Layer w0.254: Q7.3 24.13,3.61 LED3.1
$1N190: length 1.3
  Top Layer w0.254: R24.2 23.48,2.15 LED3.2
$1N192: length 2
  Top Layer w0.254: GPS Module L76X.13 9.73,8.07 CN2.1
$1N195: length 3.1
  Top Layer w0.254: GPS Module L76X.9 20.48,14.01 RST.2
$1N260: length 2.5
  Top Layer w0.254: U6.3 15.46,41.98 U7.1
$1N261: length 2.5
  Top Layer w0.254: U8.1 20.46,41.98 U7.3
$1N262: length 2.5
  Top Layer w0.254: U8.3 25.46,41.98 U9.1
$1N263: length 2.5
  Top Layer w0.254: U9.3 30.46,41.98 U10.1
$1N264: length 2.5
  Top Layer w0.254: U14.3 30.46,36.98 U15.1
$1N265: length 2.5
  Top Layer w0.254: U14.1 25.46,36.98 U13.3
$1N266: length 2.5
  Top Layer w0.254: U13.1 20.46,36.98 U12.3
$1N267: length 2.5
  Top Layer w0.254: U11.3 15.46,36.98 U12.1
$1N268: length 2.5
  Top Layer w0.254: U16.3 15.46,31.98 U17.1
$1N269: length 2.5
  Top Layer w0.254: U17.3 20.46,31.98 U18.1
$1N270: length 2.5
  Top Layer w0.254: U18.3 25.46,31.98 U19.1
$1N271: length 2.5
  Top Layer w0.254: U19.3 30.46,31.98 U20.1
$1N272: length 2.5
  Top Layer w0.254: U25.1 30.46,26.98 U24.3
$1N273: length 2.5
  Top Layer w0.254: U23.3 25.46,26.98 U24.1
$1N274: length 2.5
  Top Layer w0.254: U23.1 20.46,26.98 U22.3
$1N275: length 2.5
  Top Layer w0.254: U21.3 15.46,26.98 U22.1
$1N276: length 2.5
  Top Layer w0.254: U27.3 15.46,21.98 U28.1
$1N277: length 2.5
  Top Layer w0.254: U29.1 20.46,21.98 U28.3
$1N278: length 2.5
  Top Layer w0.254: U29.3 25.46,21.98 U30.1
$1N280: length 2.5
  Top Layer w0.254: U31.1 30.46,21.98 U30.3
$1N292: length 25.6
  Top Layer w0.254: 10.44,22.02 11,22.59 11,23.12 12.53,24.64 31.7,24.64 32.99,25.94 32.99,27
$1N293: length 25.6
  Top Layer w0.254: 33.19,32.08 33.19,31.02 31.9,29.73 12.73,29.73 11.2,28.21 11.2,27.67 10.64,27.11
$1N294: length 25.6
  Top Layer w0.254: 10.64,32.1 11.2,32.67 11.2,33.2 12.73,34.72 31.9,34.72 33.19,36.02 33.19,37.08
$1N295: length 25.6
  Top Layer w0.254: U10.3 33.04,40.92 31.75,39.62 12.57,39.62 11.05,38.1 11.05,37.57 U11.1
$1N301: length 1.9
  Top Layer w0.254: R28.1 36.25,10.62 LED1.1

## Copper pours and planes (outline as drawn; the poured copper is in the pictures)
GND on Top Layer: 0,57.66 65.02,57.66 65.02,-0.13 0,-0.13
GND on Top Layer: 55.5,18.8 57.51,18.8 57.51,11.71 55.5,11.71
GND on Bottom Layer: -0.89,57.91 65.53,57.91 65.53,-0.51 -0.89,-0.51
GND on Inner1: -0.25,57.53 65.53,57.53 65.53,-0.13 -0.25,-0.13
VCC on Inner2: -0.25,57.53 65.79,57.53 65.79,-0.25 -0.25,-0.25

## Text on the board
Bottom Silkscreen Layer: PI ESSENTIAL HAT
Top Silkscreen Layer: Baro. | MIC | 5 X 5 RGB Matrix
